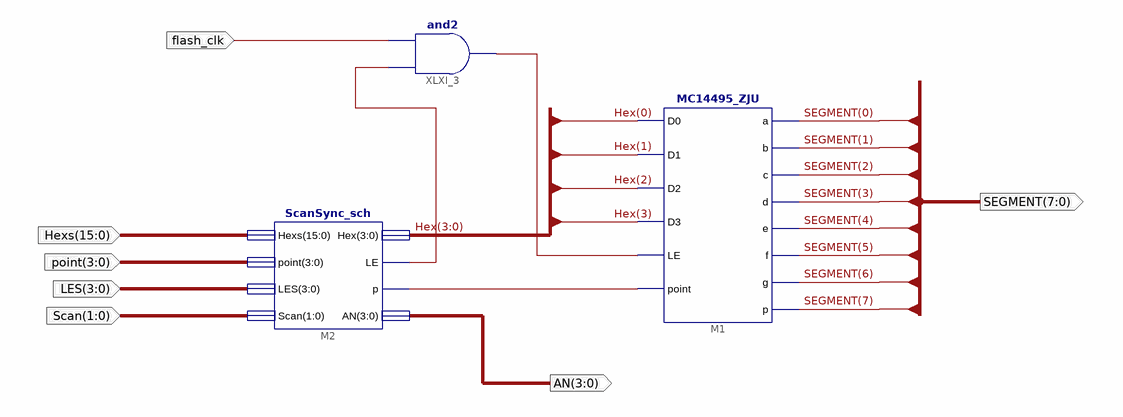
[diagram p0: schematic sheet 1]
// Xilinx ISE schematic Seg7_Dev16.sch (kintex7) as structural Verilog: 3 symbols, 7 ports
module Seg7_Dev16 (
  input  [1:0] Scan,
  input  [3:0] LES,
  input  [3:0] point,
  input  [15:0] Hexs,
  input  flash_clk,
  output [3:0] AN,
  output [7:0] SEGMENT
);

  wire XLXN_1, XLXN_22, XLXN_23;
  wire [3:0] Hex;

  MC14495_ZJU M1 (
    .D0(Hex[0]), .D1(Hex[1]), .D2(Hex[2]), .D3(Hex[3]), .LE(XLXN_23), .point(XLXN_1), .a(SEGMENT[0]),
    .b(SEGMENT[1]), .c(SEGMENT[2]), .d(SEGMENT[3]), .e(SEGMENT[4]), .f(SEGMENT[5]), .g(SEGMENT[6]),
    .p(SEGMENT[7]));
  ScanSync_sch M2 (.Hexs(Hexs), .point(point), .LES(LES), .Scan(Scan), .Hex(Hex), .LE(XLXN_22), .p(XLXN_1), .AN(AN));
  and XLXI_3 (XLXN_23, XLXN_22, flash_clk);
endmodule
